# EAGLE design SSOP to DIP 20 pin (EAGLE 5.06)
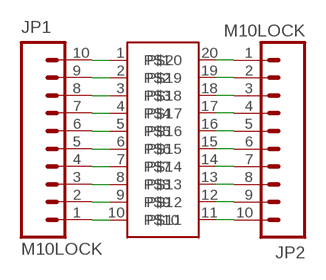
[diagram p0: schematic, sheet 1]

## Parts
JP1  M10LOCK  [1X10_LOCK]
JP2  M10LOCK  [1X10_LOCK]
U$2  SSOP20  [TSSOP20]

## Nets
N$1: JP1.1 U$2.10
N$2: JP1.2 U$2.9
N$3: JP1.3 U$2.8
N$4: JP1.4 U$2.7
N$5: JP1.5 U$2.6
N$6: JP1.6 U$2.5
N$7: JP1.7 U$2.4
N$8: JP1.8 U$2.3
N$9: JP1.9 U$2.2
N$10: JP1.10 U$2.1
N$11: JP2.1 U$2.20
N$12: JP2.2 U$2.19
N$13: JP2.3 U$2.18
N$14: JP2.4 U$2.17
N$15: JP2.5 U$2.16
N$16: JP2.6 U$2.15
N$17: JP2.7 U$2.14
N$18: JP2.8 U$2.13
N$19: JP2.9 U$2.12
N$20: JP2.10 U$2.11

## Library data of the parts
JP1 JP2 = SparkFun:M10: Header 10 Standard 10-pin 0.1" header. Use with straight break away headers (SKU : PRT-00116), right angle break away headers (PRT-00553), swiss pins (PRT-00743), machine pins (PRT-00117), and female headers (PRT-00115).
U$2 = brokenlcd:SSOP20

## Board
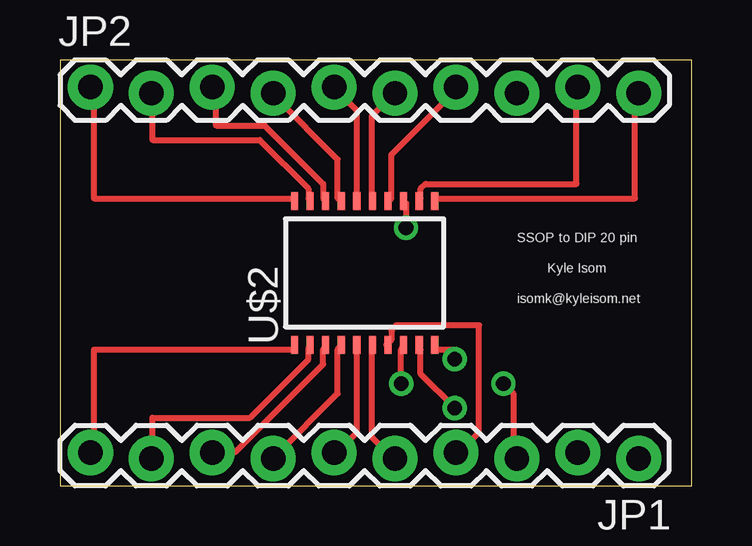
[diagram p1: board, top side]
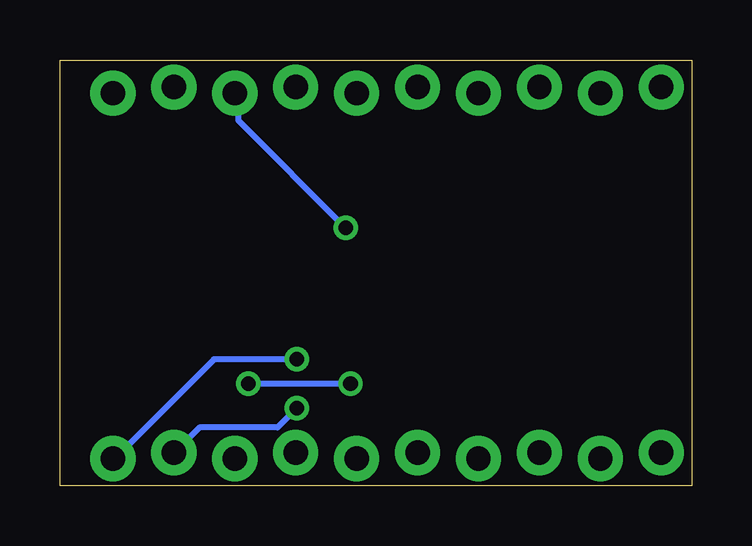
[diagram p2: board, bottom side, seen from below]

Size 26.34 x 17.77 mm. Coordinates in mm from the lower left corner, seen from the top.
Outline: 0,0 26.34,0 26.34,17.77 0,17.77 0,0
Copper layers (1*16): Top 0.035mm / dielectric 1.5mm / Bottom 0.035mm
Design rules "default": minimum track width 10mil, minimum drill 24mil, track to track 8mil, track to pad 8mil, pad to pad 8mil, via to via 8mil, smd to smd 8mil, copper to edge 40mil, drill to drill 8mil, minimum pad ring 10mil, minimum via ring 8mil, stop-mask expansion 4mil, vias tented up to drill 0mil, thermal gap 10mil

### Footprints (pad centres in the part's own frame; a part is rotated, then mirrored left to right if it is on the bottom)
1X10_LOCK = drill 1.016 pad 1.88 round: 1 0,0.127; 2 2.54,-0.127; 3 5.08,0.127; 4 7.62,-0.127; 5 10.16,0.127; 6 12.7,-0.127; 7 15.24,0.127; 8 17.78,-0.127; 9 20.32,0.127; 10 22.86,-0.127
TSSOP20 = smd 0.75 x 0.3: 1 -3,2.925; 2 -3,2.275; 3 -3,1.625; 4 -3,0.975; 5 -3,0.325; 6 -3,-0.325; 7 -3,-0.975; 8 -3,-1.625; 9 -3,-2.275; 10 -3,-2.925; 11 3,-2.925; 12 3,-2.275; 13 3,-1.625; 14 3,-0.975; 15 3,-0.325; 16 3,0.325; 17 3,0.975; 18 3,1.625; 19 3,2.275; 20 3,2.925

### Placement (x,y rotation side)
JP1  24.13,1.27 180 top
JP2  1.27,16.51 0 top
U$2  12.7,8.89 90 top

### Tracks (layer width: path | path; a pad name or v marks a point on that pad's centre or on a via)
N$1  (via drill 0.61)
  Top 0.254: v16.46,5.28 16.46,5.69 15.65,5.69 U$2.10
  Bottom 0.254: v16.46,5.28 19.91,5.28 23.98,1.22 JP1.1
N$2  (via drill 0.61)
  Top 0.254: v16.46,3.25 15.04,4.67 15.04,5.69 U$2.9
  Bottom 0.254: v16.46,3.25 17.27,2.44 20.52,2.44 21.54,1.42 JP1.2
N$3  (via drill 0.61)
  Top 0.254: v14.22,4.27 14.22,5.69 U$2.8 | v18.49,4.27 18.9,3.86 18.9,1.22 JP1.3
  Bottom 0.254: v14.22,4.27 v18.49,4.27
N$4
  Top 0.254: U$2.7 13.61,5.89 13.82,6.1 13.82,6.5 14.02,6.71 17.48,6.71 17.48,2.23 16.66,1.42 JP1.4
N$5
  Top 0.254: U$2.6 13.01,5.69 13.01,2.03 13.82,1.22 JP1.5
N$6
  Top 0.254: U$2.5 12.39,5.69 12.39,2.23 11.58,1.42 JP1.6
N$7
  Top 0.254: U$2.4 11.58,5.69 11.58,3.86 8.94,1.22 JP1.7
N$8
  Top 0.254: U$2.3 10.97,5.69 10.97,5.08 7.32,1.42 6.5,1.42 JP1.8
N$9
  Top 0.254: U$2.2 10.36,5.69 10.36,5.28 7.92,2.85 3.86,2.85 3.86,1.22 JP1.9
N$10
  Top 0.254: U$2.1 9.75,5.69 1.42,5.69 1.42,1.42 JP1.10
N$11
  Top 0.254: U$2.20 9.75,11.99 1.42,11.99 1.42,16.46 JP2.1
N$12
  Top 0.254: U$2.19 10.36,11.99 10.36,12.39 8.33,14.43 3.86,14.43 3.86,16.26 JP2.2
N$13
  Top 0.254: U$2.18 10.97,11.99 10.97,12.6 8.53,15.04 6.5,15.04 6.5,16.46 JP2.3
N$14
  Top 0.254: U$2.17 11.58,11.99 11.58,13.61 8.94,16.26 JP2.4
N$15
  Top 0.254: U$2.16 12.39,11.99 12.39,15.65 11.58,16.46 JP2.5
N$16
  Top 0.254: U$2.15 13.01,11.99 13.01,15.44 13.82,16.26 JP2.6
N$17
  Top 0.254: U$2.14 13.82,11.99 13.82,13.82 16.46,16.46 JP2.7
N$18  (via drill 0.61)
  Top 0.254: v14.43,10.77 14.43,11.79 U$2.13
  Bottom 0.254: v14.43,10.77 18.9,15.24 18.9,16.26 JP2.8
N$19
  Top 0.254: U$2.12 15.04,11.99 15.04,12.39 15.24,12.6 21.54,12.6 21.54,16.46 JP2.9
N$20
  Top 0.254: U$2.11 15.65,11.99 23.98,11.99 23.98,16.26 JP2.10

### Text on the board
tPlace: SSOP to DIP 20 pin | Kyle Isom | isomk@kyleisom.net